# Altium schematic sheet DualDriverStepperLeft.SchDoc
size A
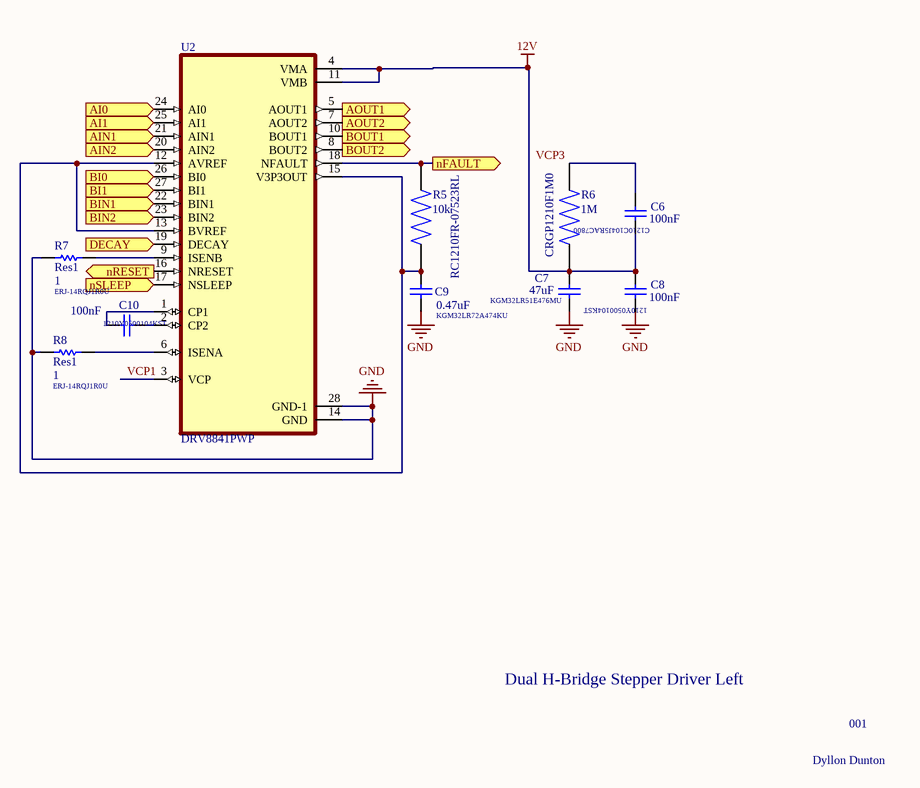
[diagram p0: DualDriverStepperLeft.SchDoc]

## Parts
C6  value 100nF  [C1210]  (hidden comment: Cap)
C7  value 47uF  [C1210]  (hidden comment: Cap)
C8  value 100nF  [C1210]  (hidden comment: Cap)
C9  value 0.47uF  [C1210]  (hidden comment: Cap)
C10  value 100nF  [C1210]  (hidden comment: Cap)
R5  RC1210FR-07523RL  value 10k  [RESC3126X65N]
R6  CRGP1210F1M0  value 1M  [RESC3126X65N]
R7  Res1  value 1  [RES_ERJ14RQJ1R0U]
R8  Res1  value 1  [RES_ERJ14RQJ1R0U]
U2  DRV8841PWP  [IC_TPS61196PWPRQ1]

## Ports
AI0 (in), AI1 (in), AIN1 (in), AIN2 (in), AOUT1 (out), AOUT2 (out), BI0 (in), BI1 (in), BIN1 (in), BIN2 (in), BOUT1 (out), BOUT2 (out), DECAY (in), nFAULT (out), nRESET (in), nSLEEP (in)

## Nets
12V: C6.2 C7.2 C8.1 R6.1 U2.4(VMA) U2.11(VMB)
GND: C7.1 C8.2 C9.1 R7.1 R8.1 U2.14(GND) U2.28(GND-1)
AI0: U2.24(AI0) ; port AI0
AI1: U2.25(AI1) ; port AI1
AIN1: U2.21(AIN1) ; port AIN1
AIN2: U2.20(AIN2) ; port AIN2
AOUT1: U2.5(AOUT1) ; port AOUT1
AOUT2: U2.7(AOUT2) ; port AOUT2
BI0: U2.26(BI0) ; port BI0
BI1: U2.27(BI1) ; port BI1
BIN1: U2.22(BIN1) ; port BIN1
BIN2: U2.23(BIN2) ; port BIN2
BOUT1: U2.10(BOUT1) ; port BOUT1
BOUT2: U2.8(BOUT2) ; port BOUT2
DECAY: U2.19(DECAY) ; port DECAY
nFAULT: R5.2 U2.18(NFAULT) ; port nFAULT
nRESET: U2.16(NRESET) ; port nRESET
nSLEEP: U2.17(NSLEEP) ; port nSLEEP
VCP1: U2.3(VCP)
NetC6_1: C6.1 R6.2
NetC9_2: C9.2 R5.1 U2.12(AVREF) U2.13(BVREF) U2.15(V3P3OUT)
NetC10_1: C10.1 U2.2(CP2)
NetC10_2: C10.2 U2.1(CP1)
NetR7_2: R7.2 U2.9(ISENB)
NetR8_2: R8.2 U2.6(ISENA)

## Notes on the sheet
- (near C6) C1210C104J5RAC7800
- ERJ-14RQJ1R0U
- 1210Y0500104KST
- (near C9) KGM32LR72A474KU
- (near C7) KGM32LR51E476MU
- (near C8) 1210Y0500104KST
- (near R8) ERJ-14RQJ1R0U
- Dual H-Bridge Stepper Driver Left
- 001
- Dyllon Dunton
- Labels drawn without touching a wire or pin: VCP3

## Library data of the parts
C6-C10 = Cap: Capacitor; Published: 8-Jun-2000; LatestRevisionDate: 17-Jul-2002; LatestRevisionNote: Re-released for DXP Platform.; PackageReference: RAD-0.3; Publisher: Altium Limited; PackageDescription: Radial Cap, Thru-Hole; 2 Leads; 0.3 in Pin Spacing
R5 R6 = RC1210FR-07523RL: 523 Ohms Â±1% 0.5W, 1/2W Chip Resistor 1210 _3225 Metric_ Moisture Resistant Thick Film; MF: Yageo; Package: 3126 Yageo; Availability: Unavailable; MP: RC1210FR-07523RL; SnapEDA_Link: https://www.snapeda.com/parts/RC1210FR-07523RL/Yageo/view-part/1091979/?ref=snap; Price: None
R7 R8 = Res1: Resistor; Published: 8-Jun-2000; LatestRevisionDate: 17-Jul-2002; LatestRevisionNote: Re-released for DXP Platform.; PackageReference: AXIAL-0.3; Publisher: Altium Limited; PackageDescription: Axial Device, Thru-Hole; 2 Leads; 0.3 in Pin Spacing
U2 = DRV8841PWP: 45-V, 2.5-A bipolar stepper or dual H-bridge motor driver IC with current regulation and PWM control; MF: Texas Instruments; Value: *; SnapEDA_Link: https://www.snapeda.com/parts/DRV8841PWP/Texas+Instruments/view-part/?ref=snap; Check_prices: https://www.snapeda.com/parts/DRV8841PWP/Texas+Instruments/view-part/?ref=eda; Purchase-URL: https://pricing.snapeda.com/search/part/DRV8841PWP/?ref=eda; Availability: In Stock; Price: None; Package: HTSSOP-28 Texas Instruments; MP: DRV8841PWP